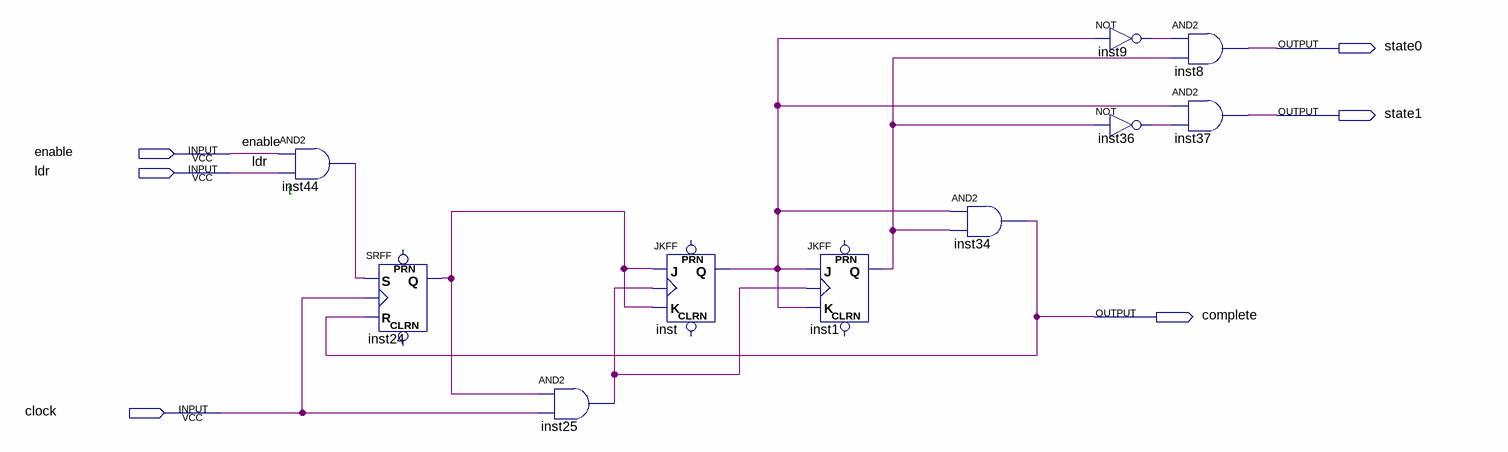
[diagram p0: schematic sheet]
// Quartus schematic ldr_decode.bdf as structural Verilog: 10 symbols, 6 pins
module ldr_decode (
  input  enable,
  input  ldr,
  input  clock,
  output state0,
  output state1,
  output complete
);

  wire inst1_q, inst9_out, inst24_q, inst25_out, inst36_out, inst44_out, inst_q;

  and inst44 (inst44_out, enable, ldr);
  SRFF inst24 (.S(inst44_out), .R(complete), .CLK(clock), .Q(inst24_q));  // open: PRN, CLRN
  and inst25 (inst25_out, inst24_q, clock);
  JKFF inst (.K(inst24_q), .J(inst24_q), .CLK(inst25_out), .Q(inst_q));  // open: PRN, CLRN
  JKFF inst1 (.K(inst_q), .J(inst_q), .CLK(inst25_out), .Q(inst1_q));  // open: PRN, CLRN
  and inst34 (complete, inst_q, inst1_q);
  not inst9 (inst9_out, inst_q);
  not inst36 (inst36_out, inst1_q);
  and inst8 (state0, inst9_out, inst1_q);
  and inst37 (state1, inst_q, inst36_out);

  // Notes on the sheet:
  //   t
endmodule
